# EasyEDA Pro project VoltageConverter_v2_2.eprj

# Schematic Schematic1
Board Name: Board1; Create Date: 2025-04-11; Page Name: P1; Project Name: VoltageConverter_v2_2; Schematic Name: Schematic1; Update Date: 2025-04-12; Company: 嘉立创EDA; Drawed: 王大智; Page Size: A4; Version: V1.0
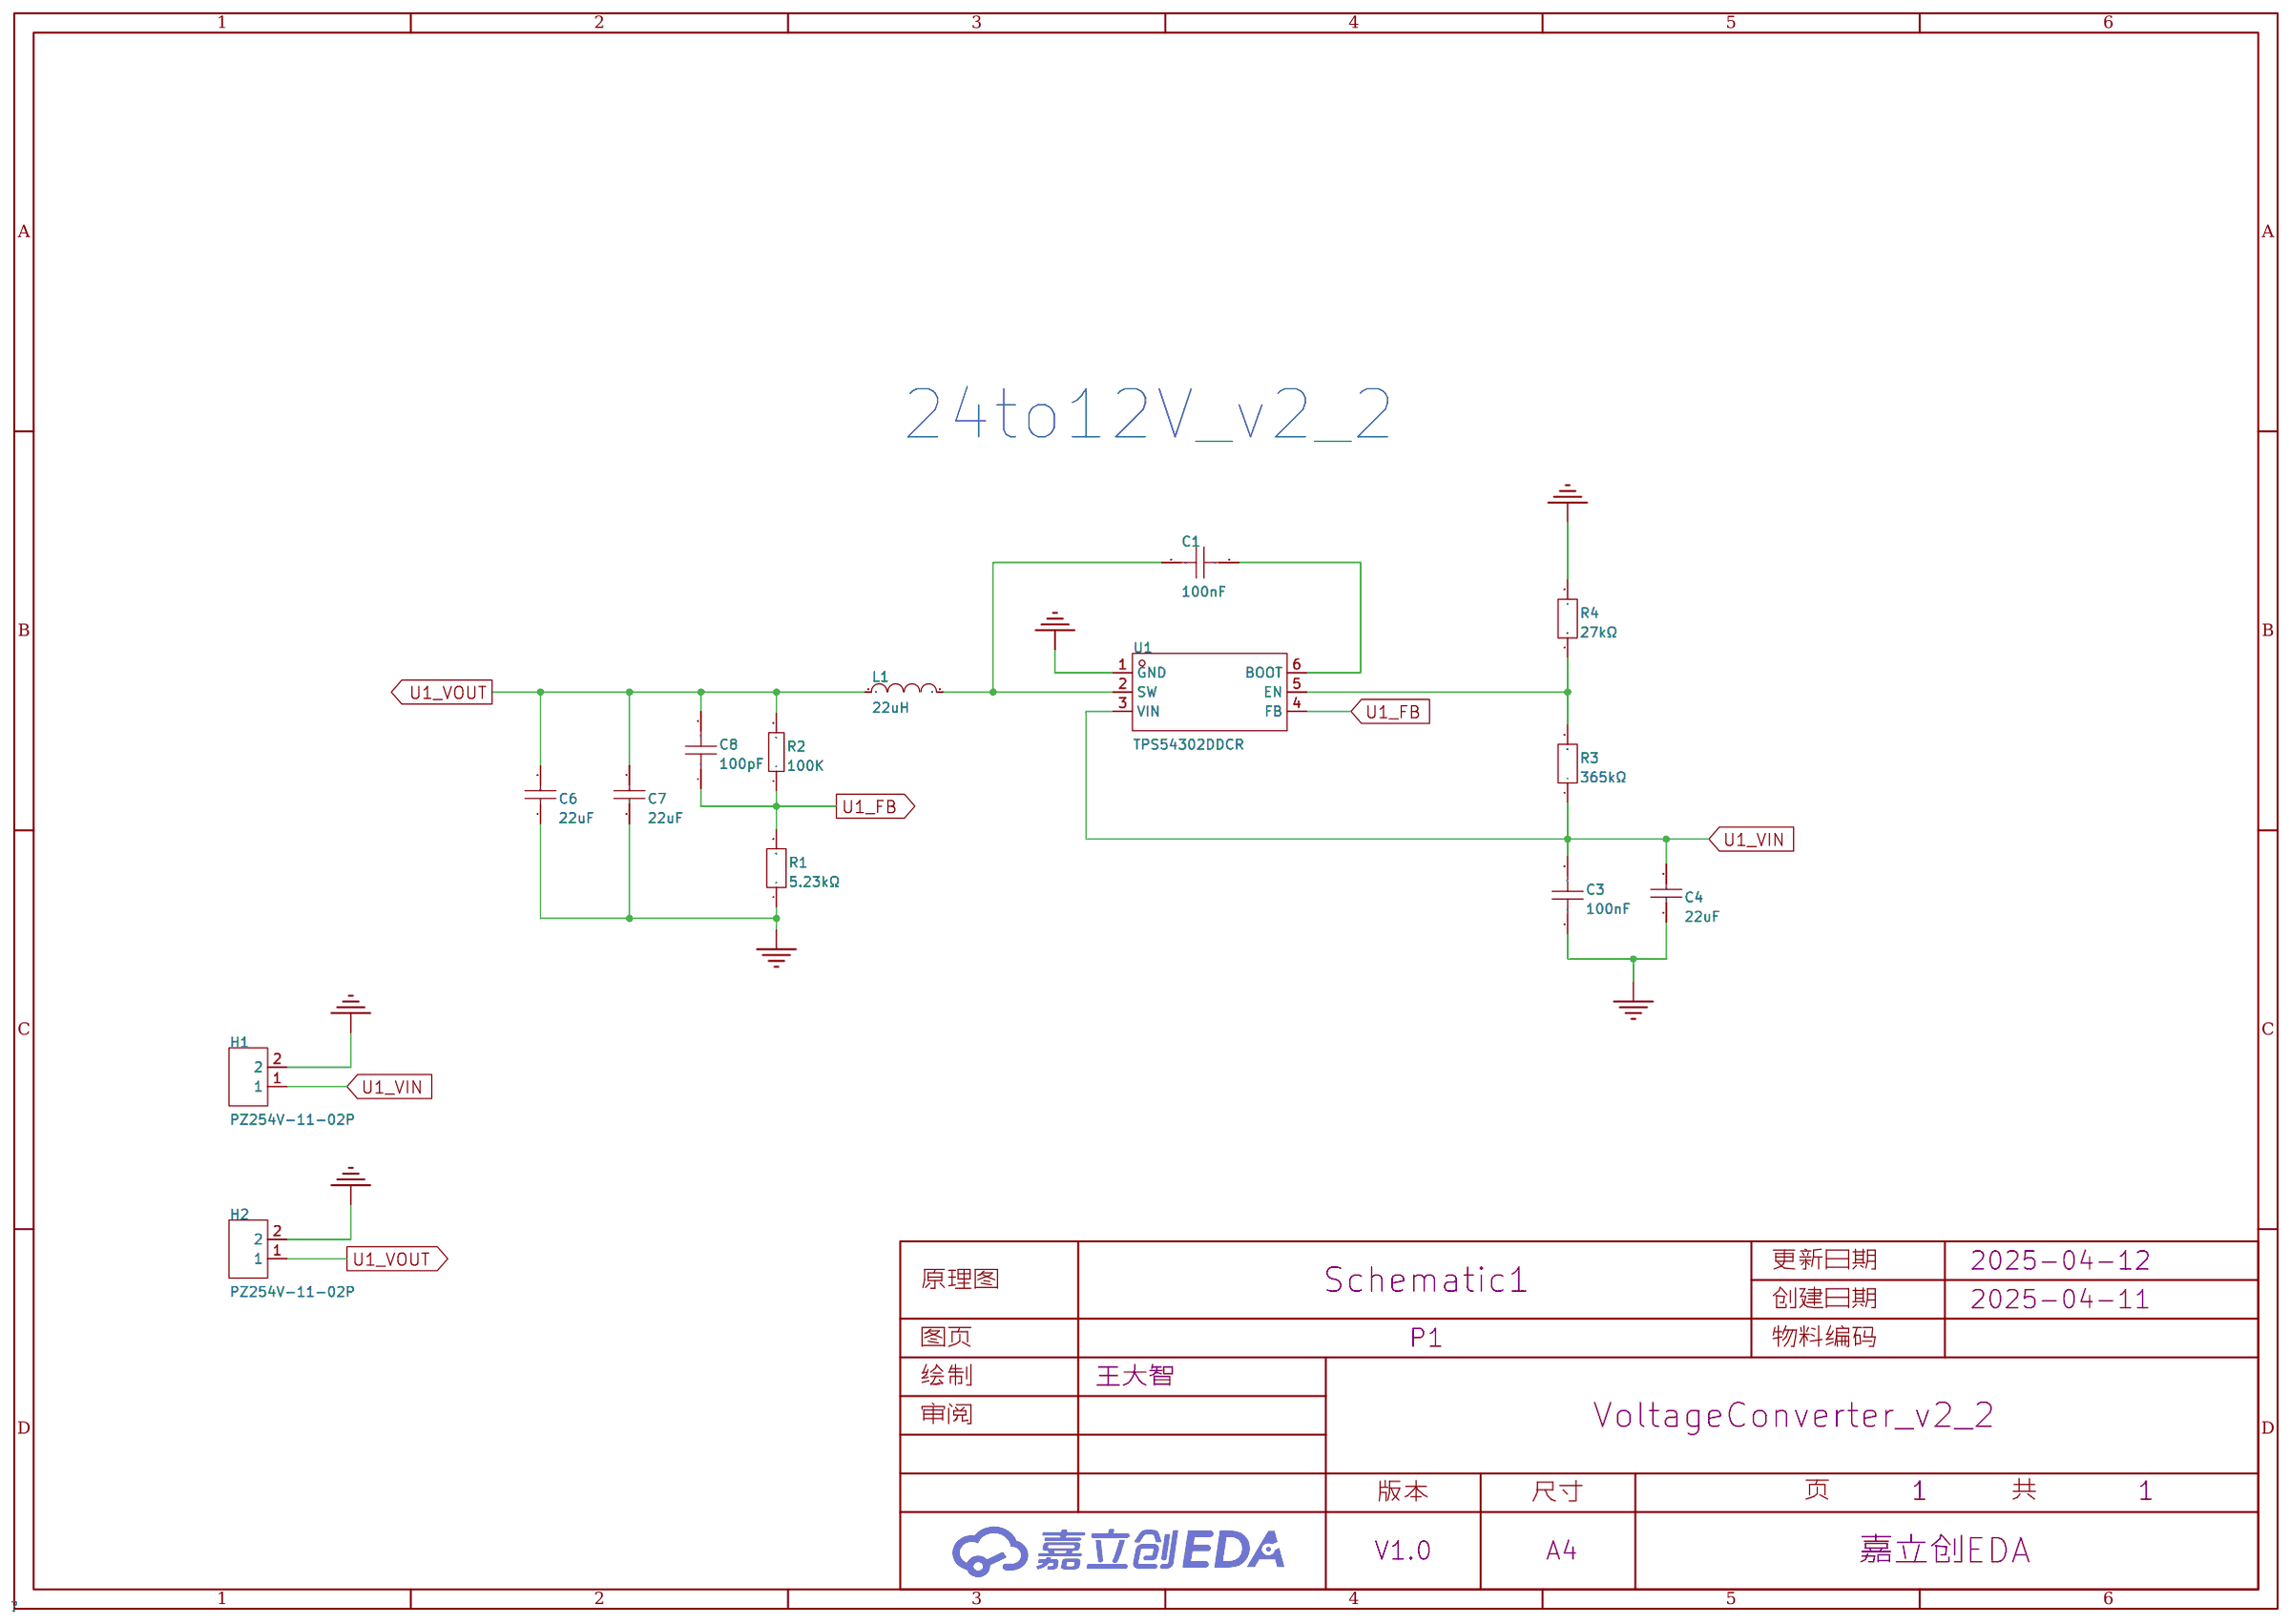
[diagram p0: schematic sheet]

## Parts
C1  100nF  [C0603]
C3  100nF  [C0603]
C4  22uF  [C1206]
C6  22uF  [C1206]
C7  22uF  [C1206]
C8  100pF  [C0603]
H1  PZ254V-11-02P  [HDR-TH_2P-P2.54-V-M]
H2  PZ254V-11-02P  [HDR-TH_2P-P2.54-V-M]
L1  22uH  [IND-SMD_L7.0-W6.6_FXL0630]
R1  5.23kΩ  [R0805]
R2  100K  [R0603]
R3  365kΩ  [R1210]
R4  27kΩ  [R0603]
U1  TPS54302DDCR  [SOT-23-6_L2.9-W1.6-P0.95-LS2.8-BL]

## Library data of the parts
C1 C3 = CAP_0603: Supplier Footprint: 0603
C4 C6 C7 = CL31A226KAHNNNE: LCSC Part Name: 22uF ±10% 25V; Supplier Part: C12891; Manufacturer: SAMSUNG(三星); Supplier Footprint: 1206; JLCPCB Part Class: 基础库; Datasheet: https://atta.szlcsc.com/upload/public/pdf/source/20160218/1457707763339.pdf; Supplier: LCSC; Tolerance: ±10%; Voltage Rated: 25V; Temperature Coefficient: X5R
C8 = CC0603JRNPO9BN101: LCSC Part Name: 100pF ±5% 50V; Supplier Part: C14665; Manufacturer: YAGEO(国巨); Supplier Footprint: 0603; JLCPCB Part Class: 扩展库; Datasheet: https://atta.szlcsc.com/upload/public/pdf/source/20181008/C309499_21CC21451B82C39E3D92150FD6B30293.pdf; Supplier: LCSC; Tolerance: ±5%; Voltage Rated: 50V; Temperature Coefficient: NP0
H1 H2 = PZ254V-11-02P: LCSC Part Name: 1x2P 间距:2.54mm 方针 直插; Supplier Part: C492401; Manufacturer: XFCN(兴飞); Supplier Footprint: 插件,P=2.54mm; JLCPCB Part Class: 扩展库; Datasheet: https://atta.szlcsc.com/upload/public/pdf/source/20200309/C492401_A812433581A9B211A7FFA413ADDFF0E5.pdf; Supplier: LCSC; Pin Structure: 1x2P; Pitch: 2.54mm; Circluar Pins/Square Pins: 方针; Mounting Type: 直插; Number of Rows: 单排; Number of Pins: 2P; Length of Mating Pin: 6mm; Insulation Height: 2.5mm; Length of End Connection Pin: 3mm; Contact Material: 黄铜; Operating Temperature: -40℃~+105℃; Color: 黑色
L1 = FXL0630-220-M: LCSC Part Name: 22uH ±20% 3A; Supplier Part: C177244; Manufacturer: cjiang(长江微电); Supplier Footprint: SMD,6.6x7mm; JLCPCB Part Class: 扩展库; Datasheet: https://atta.szlcsc.com/upload/public/pdf/source/20240426/3189EA8206330E2108542F9E34E540E7.pdf; Supplier: LCSC; Tolerance: ±20%; Rated Current: 2.5A; Saturation Current (Isat): 3A; DC Resistance (DCR): 200mΩ; Type: 一体成型电感
R1 = FRC0805F5231TS: LCSC Part Name: 5.23kΩ ±1% 125mW 厚膜电阻; Supplier Part: C2933464; Manufacturer: FOJAN(富捷); Supplier Footprint: 0805; JLCPCB Part Class: 扩展库; Datasheet: https://atta.szlcsc.com/upload/public/pdf/source/20211221/925EC7D7225764EE0046F22065062C87.pdf; Supplier: LCSC; Type: 厚膜电阻; Tolerance: ±1%; Power(Watts): 125mW; Voltage-Supply(Max): 150V; Temperature Coefficient: ±100ppm/℃; Operating Temperature: -55℃~+155℃
R2 = Res_0603: Supplier Footprint: 0603
R3 = AC1210FR-07365KL: LCSC Part Name: 厚膜电阻 365kΩ ±1% 500mW; Supplier Part: C230209; Manufacturer: YAGEO(国巨); Supplier Footprint: 1210; JLCPCB Part Class: 扩展库; Datasheet: https://atta.szlcsc.com/upload/public/pdf/source/20191108/C230504_7FB43CAE7E86B3B2980C2491161B254C.pdf; Supplier: LCSC; Type: 厚膜电阻; Tolerance: ±1%; Power(Watts): 500mW; Overload Voltage (Max): 200V; Temperature Coefficient: ±100ppm/℃; Operating Temperature Range: -55℃~+155℃
R4 = FRC0603F2702TS: LCSC Part Name: 27kΩ ±1% 100mW 厚膜电阻; Supplier Part: C2930084; Manufacturer: FOJAN(富捷); Supplier Footprint: 0603; JLCPCB Part Class: 扩展库; Datasheet: https://atta.szlcsc.com/upload/public/pdf/source/20211221/925EC7D7225764EE0046F22065062C87.pdf; Supplier: LCSC; Type: 厚膜电阻; Tolerance: ±1%; Power(Watts): 100mW; Voltage-Supply(Max): 75V; Temperature Coefficient: ±100ppm/℃; Operating Temperature: -55℃~+155℃
U1 = TPS54302DDCR: LCSC Part Name: 4.5V至28V输入、3A输出、EMI友好的同步降压转换器; Supplier Part: C311983; Manufacturer: TI(德州仪器); Supplier Footprint: TSOT-23-6; JLCPCB Part Class: 扩展库; Datasheet: https://www.ti.com/cn/lit/gpn/tps54302; Supplier: LCSC; Function: 降压型; Output Type: 固定; Input Voltage: 4.5V~28V; Output Voltage: 5V; Output Current: 3A; Switching Frequency: 400kHz; Operating Temperature: -40℃~+125℃; Synchronous Rectification: 是; Number of Outputs: 1; Topology: 降压式; Quiescent Current (Iq): 45uA; Switch tube (built-in/external): 内置

## Nets
GND: C3.1 C4.1 C6.1 C7.1 H1.2 H2.2 R1.1 R4.2 U1.1(GND)
U1_FB: C8.1 R1.2 R2.1 U1.4(FB)
U1_VIN: C3.2 C4.2 H1.1 R3.1 U1.3(VIN)
U1_VOUT: C6.2 C7.2 C8.2 H2.1 L1.1 R2.2
$1N255: C1.1 L1.2 U1.2(SW)
$1N263: C1.2 U1.6(BOOT)
$1N1550: R3.2 R4.1 U1.5(EN)

## Notes on the sheet
- 24to12V_v2_2

# Board PCB1
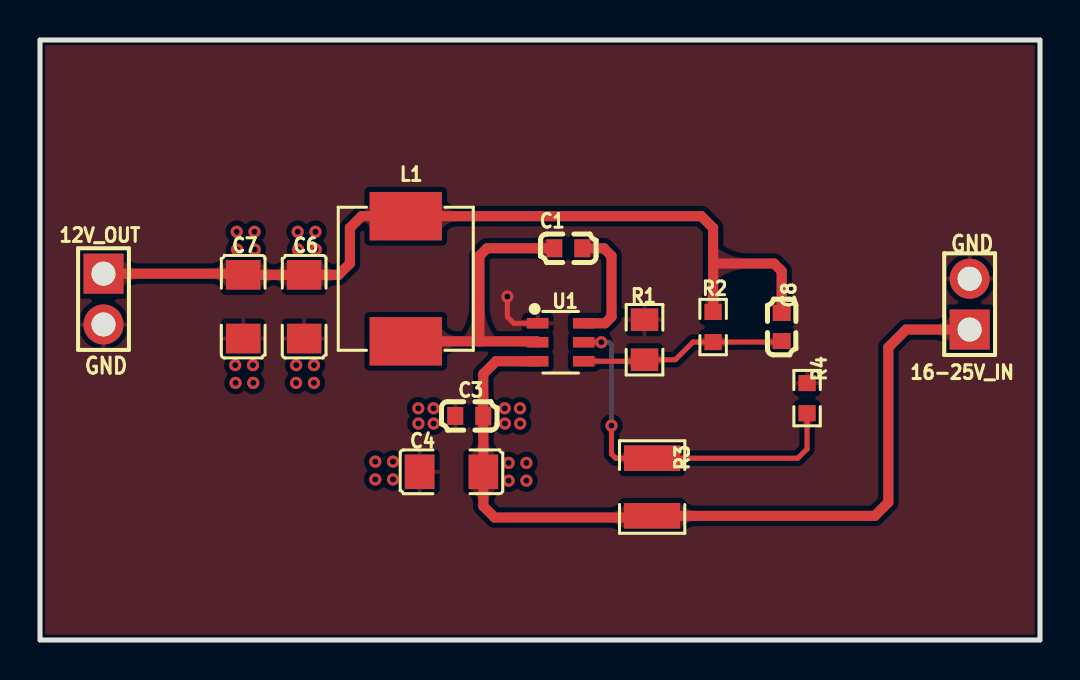
[diagram p1: board, top side]
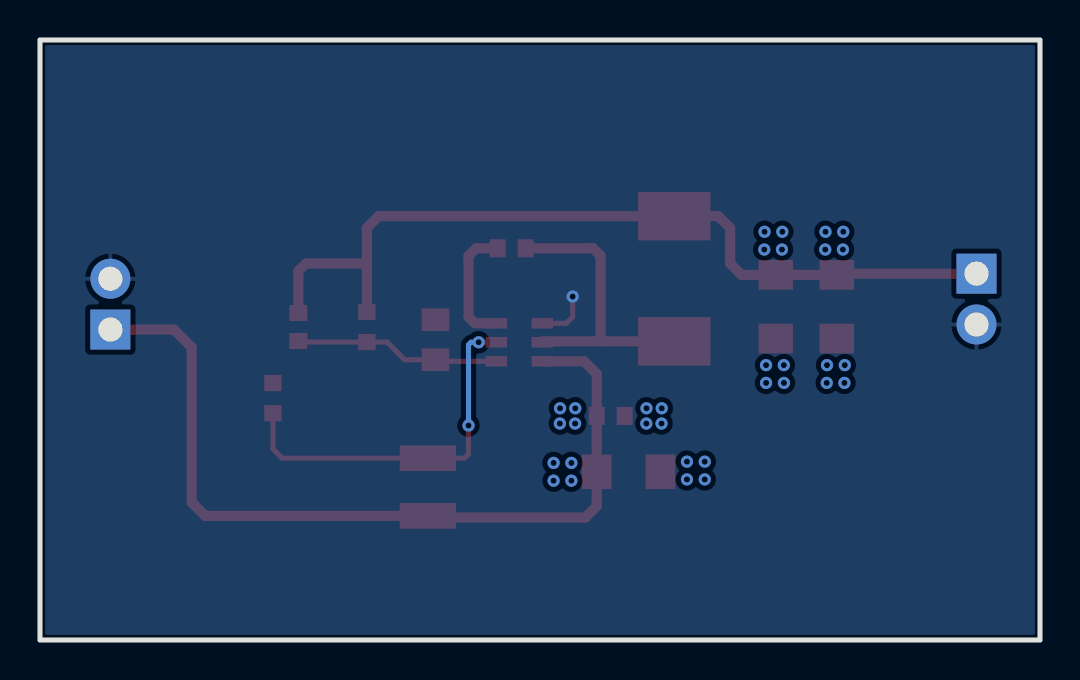
[diagram p2: board, bottom side, seen from below]

Outline 50 x 30 mm; copper layers: Top Layer, Bottom Layer. Coordinates in mm from the lower left corner of the outline.
Outline path: rectangle 0,30 50,0
Stack: Top Layer 0.035mm / Dielectric1 1.51mm FR4 er 4.5 / Bottom Layer 0.035mm

## Design rules (mm)
template: JLCPCB Capability(Two Layers Board)
spacing copperThickness1oz (default): track to track 0.102, other pairs 0.152 to 0.3
spacing copperThickness2oz: track to track 0.203, other pairs 0.152 to 0.3
track width copperThickness1oz (default): min 0.127, default 0.254, max 2.54
track width copperThickness2oz: min 0.203, default 0.254, max 2.54
differential pair differentialPair (default): width min 0.127, default 0.254, max 2.54; gap min 0.152, default 0.152
via viaSize (default): diameter min 0.5, default 0.61, max 10; hole min 0.3, default 0.305, max 6.3

## Placement (name value [footprint] x y rotation side)
12V_OUT  PZ254V-11-02P  [HDR-TH_2P-P2.54-V-M]  3.18 17.05 270 top
16-25V_IN  PZ254V-11-02P  [HDR-TH_2P-P2.54-V-M]  46.48 16.79 90 top
C1  100nF  [C0603]  26.42 19.59 0 top
C3  100nF  [C0603]  21.46 11.2 0 top
C4  22uF  [C1206]  20.57 8.41 0 top
C6  22uF  [C1206]  13.21 16.67 90 top
C7  22uF  [C1206]  10.16 16.67 90 top
C8  100pF  [C0603]  37.08 15.65 90 top
L1  22uH  [IND-SMD_L7.0-W6.6_FXL0630]  18.29 18.06 90 top
R1  5.23kΩ  [R0805]  30.23 15.01 270 top
R2  100K  [R0603]  33.66 15.65 90 top
R3  365kΩ  [R1210]  30.61 7.65 90 top
R4  27kΩ  [R0603]  38.35 12.09 90 top
U1  TPS54302DDCR  [SOT-23-6_L2.9-W1.6-P0.95-LS2.8-BL]  26.03 14.89 270 top

## Footprints (pads in the part's own frame, mm; a bottom-side part is the same pattern mirrored in y, then rotated)
C0603
  rect 0.8x0.9 smd: 1(-0.7,0) 2(0.7,0)
C1206
  rect 1.485x1.728 smd: 1(-1.593,0) 2(1.593,0)
HDR-TH_2P-P2.54-V-M
  rect 2x2 hole 1.2: 1(-1.27,0)
  round 2 hole 1.2: 2(1.27,0)
IND-SMD_L7.0-W6.6_FXL0630
  rect 2.424x3.62 smd: 1(3.128,0) 2(-3.128,0)
R0603
  rect 0.806x0.864 smd: 1(-0.753,0) 2(0.753,0)
R0805
  rect 1.133x1.377 smd: 1(-1,0) 2(1,0)
R1210
  rect 1.282x2.808 smd: 1(-1.441,0) 2(1.441,0)
SOT-23-6_L2.9-W1.6-P0.95-LS2.8-BL
  rect 0.532x1.072 smd: 1(-0.95,-1.149) 2(0,-1.149) 3(0.95,-1.149) 4(0.95,1.149) 5(0,1.149) 6(-0.95,1.149)

## Nets
GND: 12V_OUT.2 16-25V_IN.2 C3.1 C4.1 C6.1 C7.1 R1.1 R4.2 U1.1
U1_FB: C8.1 R1.2 R2.1 U1.4
U1_VIN: 16-25V_IN.1 C3.2 C4.2 R3.1 U1.3
U1_VOUT: 12V_OUT.1 C6.2 C7.2 C8.2 L1.1 R2.2
$1N255: C1.1 L1.2 U1.2
$1N263: C1.2 U1.6
$1N1550: R3.2 R4.1 U1.5

## Via types
v1: diameter 0.61, hole 0.305, Top Layer to Bottom Layer, 35 vias

## Routing (per net, layer and track width the routed paths; a pad name or vN(x,y) marks a point on that pad's centre or on a via; arc(x,y) is an arc through that point)
GND: length 2.7
  Top Layer w0.254: v1(23.37,17.17) 23.37,16.16 23.69,15.84 U1.1
(no net):
  vias: v1(9.76,13.74) v1(9.78,12.86) v1(9.84,20.41) v1(9.85,19.52) v1(10.72,20.41) v1(10.65,13.74) v1(10.66,12.86) v1(10.74,19.52) v1(12.81,13.74) v1(12.8,12.86) v1(12.88,20.41) v1(12.9,19.52) v1(13.7,13.74) v1(13.7,12.86) v1(13.77,20.41) v1(13.79,19.52) v1(16.76,8.92) v1(16.76,8.03) v1(17.65,8.92) v1(17.65,8.03) v1(18.91,11.59) v1(18.92,10.82) v1(19.68,11.59) v1(19.69,10.82) v1(23.24,11.59) v1(23.25,10.82) v1(23.43,8.85) v1(23.43,7.97) v1(24,11.59) v1(24.01,10.82) v1(24.32,8.85) v1(24.32,7.97)
U1_FB: length 10.3
  Top Layer w0.254: U1.4 30.15,13.94 R1.2 31.77,14.01 32.65,14.9 R2.1 37.03,14.9 C8.1
U1_VIN: length 42.6
  Top Layer w0.508: 16-25V_IN.1 43.31,15.52 42.42,14.63 42.42,6.89 41.74,6.21 R3.1 30.52,6.12 22.73,6.12 22.17,6.69 C4.2 22.17,11.2 C3.2 22.16,13.3 22.8,13.94 U1.3
U1_VOUT: length 42.9
  Top Layer w0.508: 33.66,18.82 36.7,18.82 37.08,18.44 C8.2 ; 33.66,18.82 33.66,20.6 33.07,21.19 L1.1 16.08,21.19 15.49,20.6 15.49,18.82 14.93,18.26 C6.2 C7.2 10.1,18.32 12V_OUT.1 ; 33.66,18.82 R2.2
$1N255: length 14.8
  Top Layer w0.508: 21.96,14.93 24.84,14.93 U1.2 ; 21.96,14.93 21.97,14.95 21.97,19.2 22.35,19.59 C1.1 ; 21.96,14.93 L1.2
$1N263: length 6.2
  Top Layer w0.508: C1.2 28.19,19.59 28.58,19.2 28.58,16.16 28.25,15.84 U1.6
$1N1550: length 18.7
  Top Layer w0.254: v1(28.58,10.72) 28.58,9.3 28.78,9.09 R3.2 37.89,9.09 38.35,9.55 R4.1 ; U1.5 v1(28.07,14.89)
  Bottom Layer w0.254: v1(28.58,10.72) 28.58,14.76 28.45,14.89 v1(28.07,14.89)

## Copper pours and planes (outline as drawn; the poured copper is in the pictures)
GND on Top Layer: -2.92,33.17 53.34,33.17 53.34,-4.29 -2.92,-4.29
GND on Bottom Layer: -4.32,34.7 58.17,34.7 58.17,-7.59 -4.32,-7.59

Small or netless copper shapes (teardrops, artwork), in the pictures only: 38 on Top Layer, 2 on Bottom Layer

## Text on the board
Top Silkscreen Layer: GND
